# Altium schematic sheet Pump Drive.SchDoc: Pump Drive
size A4; Organization: Altium Limited; Address1: L3, 12a Rodborough Rd; Address2: Frenchs Forest; Address3: NSW; Address4: Australia 2086; DocumentNumber: 6; Revision: D; SheetNumber: 6; SheetTotal: 7; Status: Develop
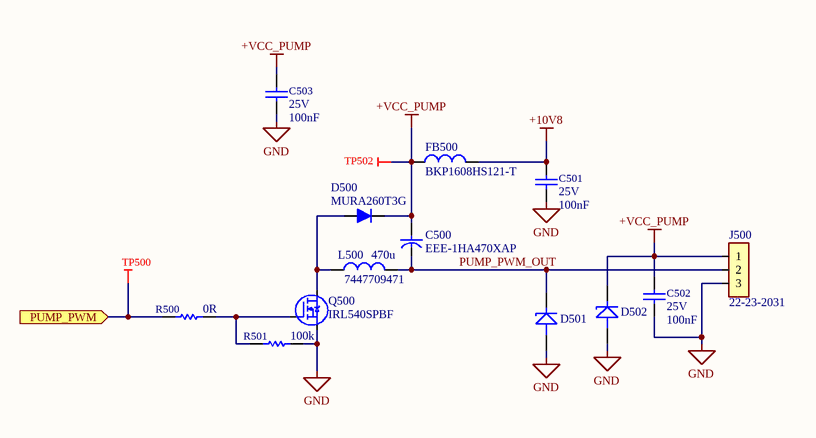
[diagram p0: Pump Drive.SchDoc]

## Parts
C500  EEE-1HA470XAP  [Panasonic S-V D8]
C501  value 100nF  Voltage: 25V  [CAPC1005X06N]  (hidden comment: 4.7uF)
C502  value 100nF  Voltage: 25V  [CAPC1005X06N]  (hidden comment: 4.7uF)
C503  value 100nF  Voltage: 25V  [CAPC1005X06N]  (hidden comment: 4.7uF)
D500  MURA260T3G  [Diode SMA DIOM5226X240N]
D501  12V TVS  [NXP PTVSxS1UR-Series (SOD123W)]  (value not drawn)
D502  12V TVS  [NXP PTVSxS1UR-Series (SOD123W)]  (value not drawn)
FB500  BKP1608HS121-T  [RESC1608X06N]
J500  22-23-2031  [22-23-2031]
L500  7447709471  value 470u  [WE-PD 1210]
Q500  IRL540SPBF  [D2PAK]
R500  value 0R  [RESC1608X06N]  (hidden comment: RES: GENERAL)
R501  value 100k  [RESC1608X06N]  (hidden comment: RES: GENERAL)
TP500  PAD  [TP_SMD_39MIL]  (value not drawn)  (no BOM)
TP502  PAD  [TP_SMD_39MIL]  (value not drawn)  (no BOM)

## Ports
PUMP_PWM (in)

## Nets
+10V8: C501.1 FB500.2
+VCC_PUMP: C500.1 C502.1 C503.1 D500.1(K) D502.1 FB500.1 J500.1 TP502.1
GND: C501.2 C502.2 C503.2 D501.2 D502.2 J500.3 Q500.3(S) R501.1
PUMP_PWM: R500.2 TP500.1 ; port PUMP_PWM
PUMP_PWM_OUT: C500.2 D501.1 J500.2 L500.2
NetD500_2: D500.2(A) L500.1 Q500.2(D)
NetQ500_1: Q500.1(G) R500.1 R501.2

## Notes on the sheet
- Title
- Size:
- Date:
- A4
- Number:
- Time:
- Revision:
- Sheet
- of
- File:

## Library data of the parts
C500 = EEE-1HA470XAP: CAP ALUM 47UF 20% 50V SMD; Manufacturer: Panasonic; Supplier 1: Digi-Key; Manufacturer Part Number: EEE-1HA470XAP; Supplier Part Number 1: PCE4622CT-ND
C501-C503 = 4.7uF_0603_10V: Manufacturer Part Number: CL05A104KA5NNNC; Manufacturer: Samsung; ComponentLink1URL: http://www.murata.com/~/media/webrenewal/support/library/catalog/products/capacitor/mlcc/c02e.pdf; ComponentLink1Description: http://www.murata.com/~/media/webrenewal/support/library/catalog/products/capacitor/mlcc/c02e.pdf; Supplier 1: Digi-Key; Supplier Part Number 1: 1276-1043-1-ND
D500 = MURA260T3G: Diode Standard 600V 2A Surface Mount SMA; Manufacturer: ON Semi; Properties: 2A/600V; Supplier Part Number 1: MURA260T3GOSCT-ND; Supplier 1: Digi-Key; Package: SMA; Manufacturer Part Number: MURA260T3G
D501 D502 = NXP PTVSxS1UR-Series: Manufacturer: Nexperia; Manufacturer Part Number: PTVS12VS1UR,115; Supplier 1: Digi-Key; Supplier Part Number 1: 1727-5325-1-ND
FB500 = BKP1608HS121-T: 120 Ohms @ 100MHz 1 Power Line Ferrite Bead 0603 (1608 Metric) 2.7A 35mOhm; Manufacturer: Taiyo Yuden; Supplier 1: Digi-Key; Supplier Part Number 1: 587-1923-1-ND; Manufacturer Part Number: BKP1608HS121-T
J500 = 22-23-2031: Connector Header Through Hole 3 position 0.100" (2.54mm); Manufacturer: Molex; Manufacturer Part Number: 0022232031; Value: *; Supplier Part Number 1: WM4201-ND; Supplier 1: Digi-Key
L500 = 7447709471: 470µH Shielded Wirewound Inductor 1.4A 560mOhm Max Nonstandard; Manufacturer: Wurth Electronics; Supplier 1: Digi-Key; Supplier Part Number 1: 732-1699-1-ND; Manufacturer Part Number: 7447709471
Q500 = IRL540SPBF: MOSFET N-CH 100V 28A D2PAK; Manufacturer: Vishay Siliconix; Value: *; Type: *; Supplier 1: Digi-Key; Supplier Part Number 1: IRL540SPBF-ND; Manufacturer Part Number: IRL540SPBF
R500 = RES: GENERAL: Manufacturer: Panasonic; Manufacturer Part Number: ERJ-3GEY0R00V; Accuracy: *; Distributor Part Number: *; Power: *; Type: *; Distributor: Digi-Key; Package: *; Supplier 1: Digi-Key; Supplier Part Number 1: P0.0GCT-ND
R501 = RES: GENERAL: Manufacturer: Panasonic; Manufacturer Part Number: ERJ-3GEYJ104V; Accuracy: *; Distributor Part Number: *; Power: *; Type: *; Distributor: Digi-Key; Package: *; Supplier 1: Digi-Key; Supplier Part Number 1: P100KGCT-ND
TP500 TP502 = TP_SMD_39MIL: SMD Test Pad; Manufacturer: No P/N Required; P/N: No P/N; UM: EA; Fast Supplier: No P/N Required; Fast Supplier P/N: No P/N Required; Manufacturer P/N: No P/N Required